# Altium project PLL.PrjPcb
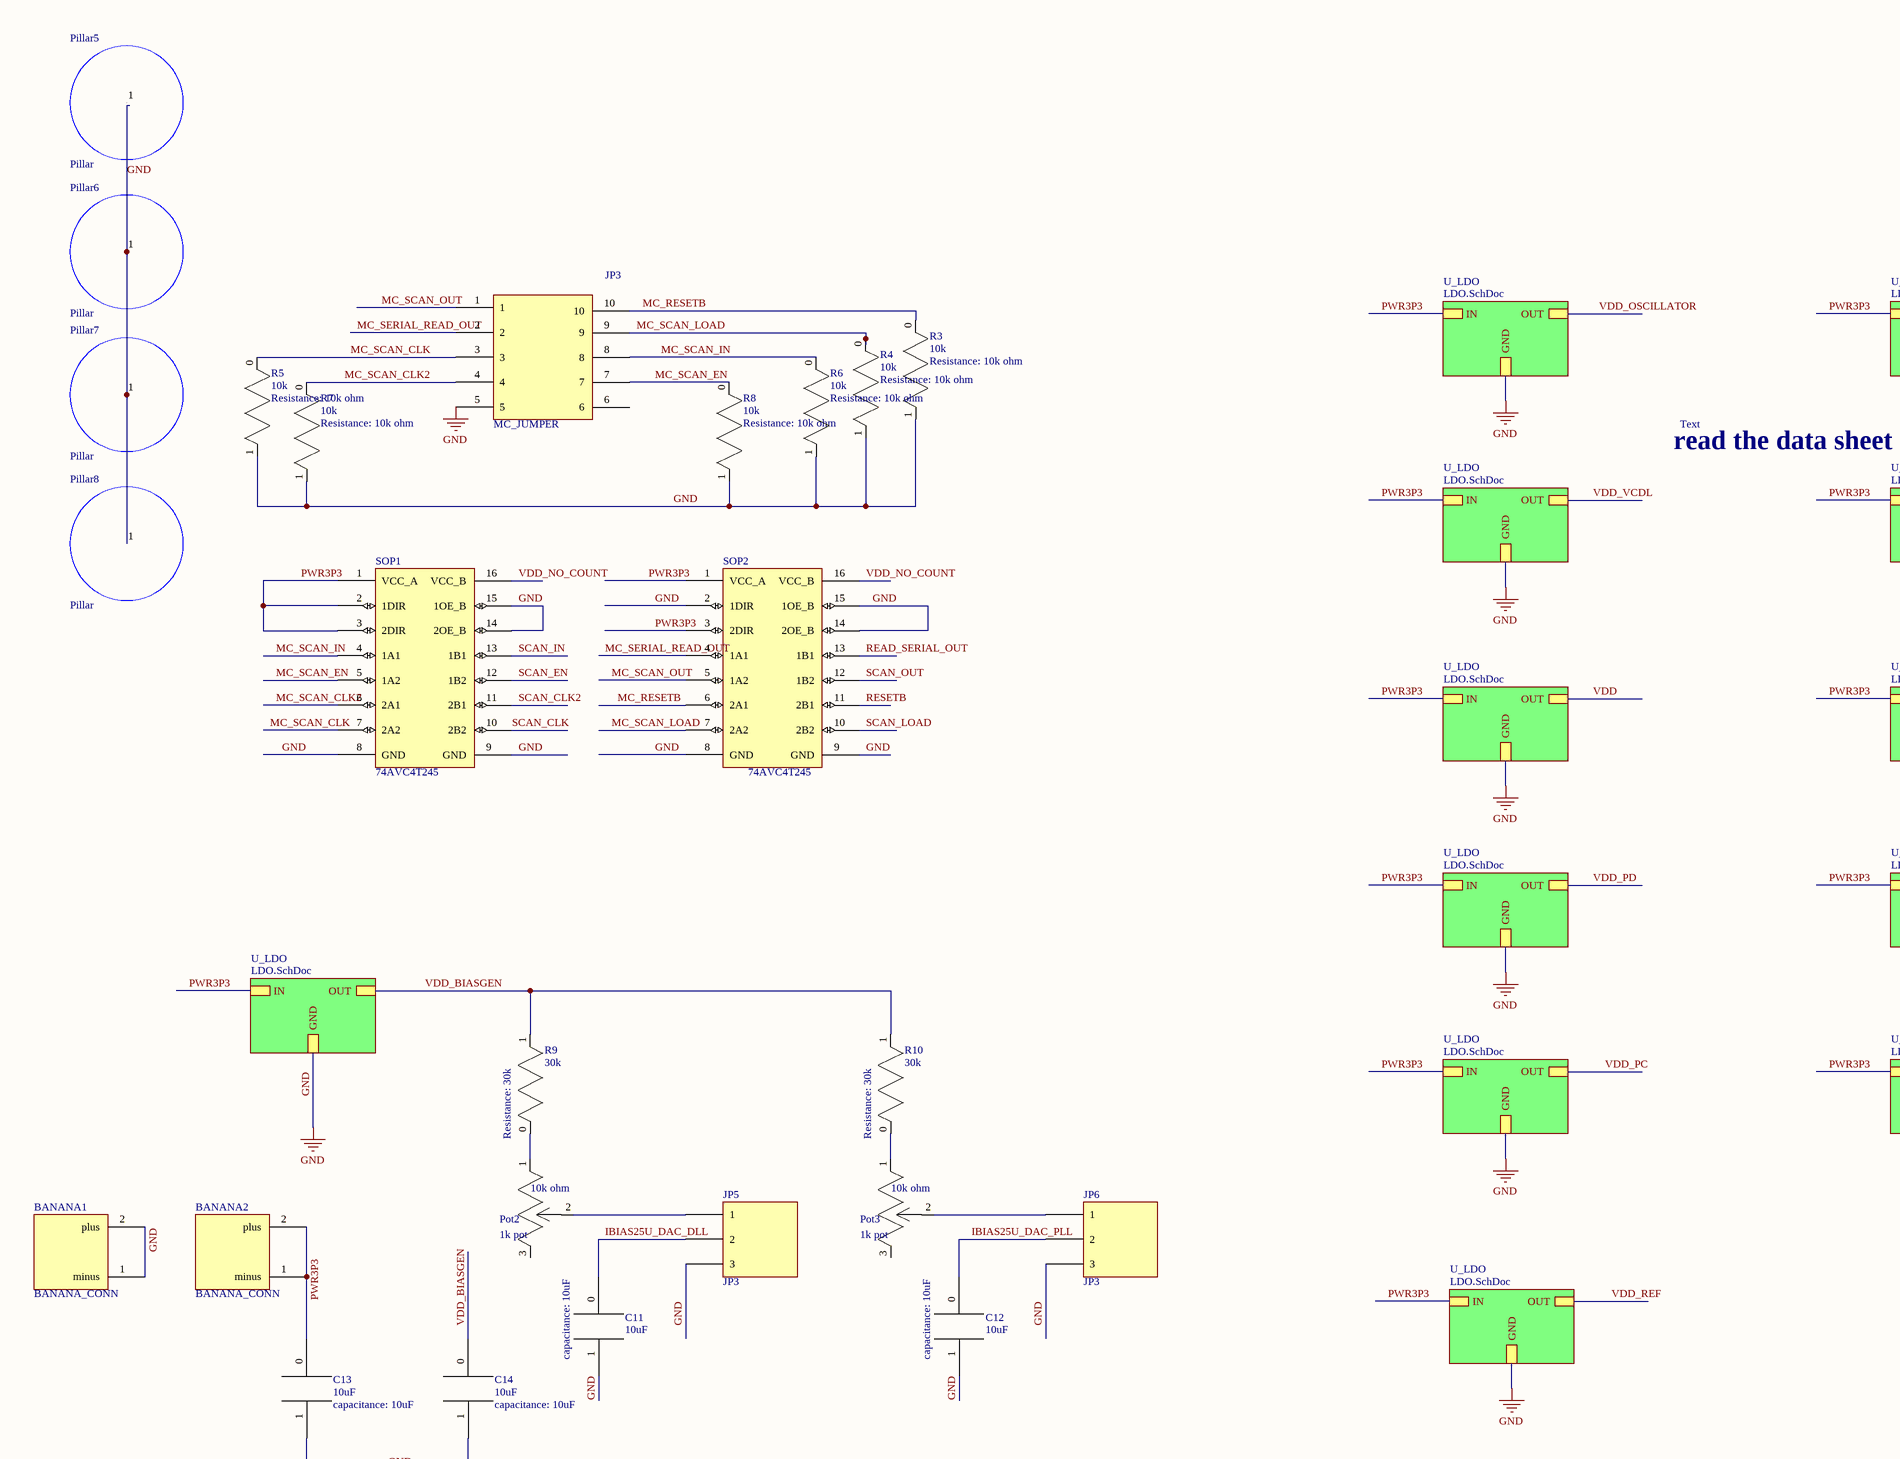
[diagram p0: MainSchematic.SchDoc, top left]
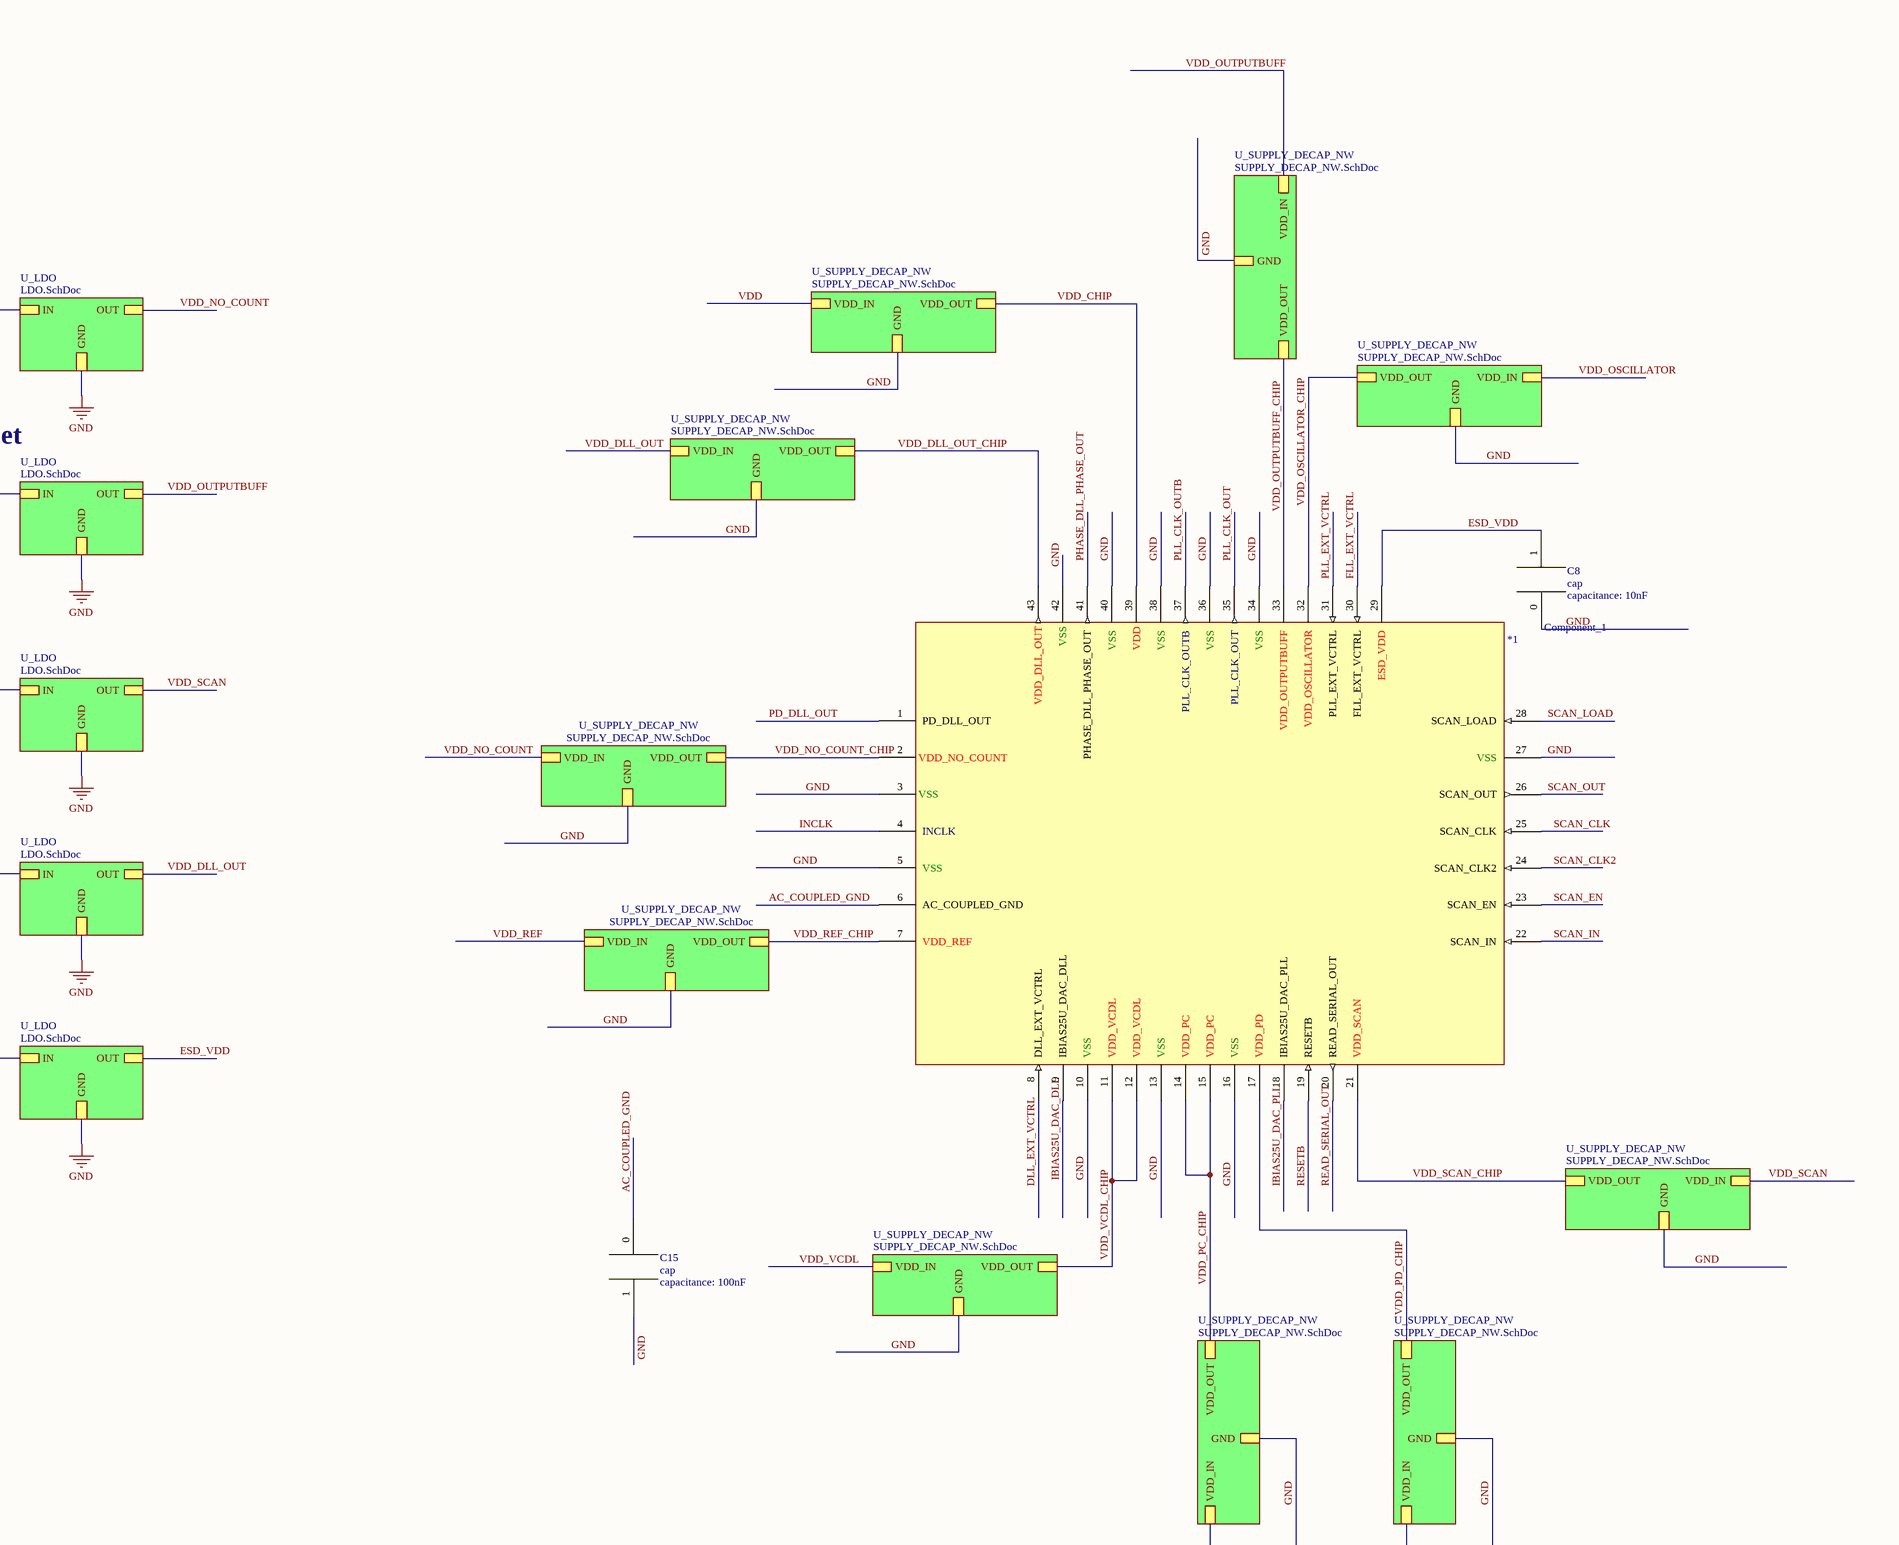
[diagram p1: MainSchematic.SchDoc, top right]
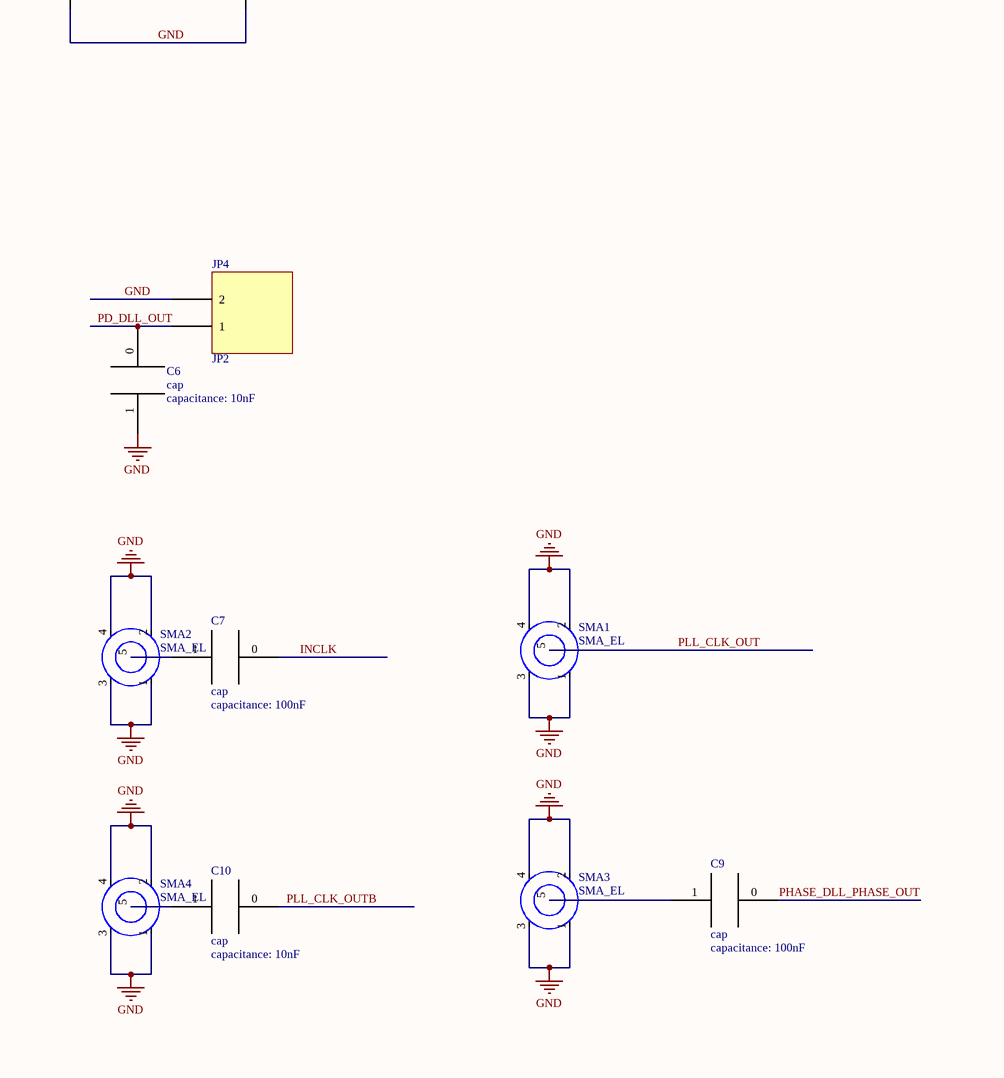
[diagram p2: MainSchematic.SchDoc, bottom left]
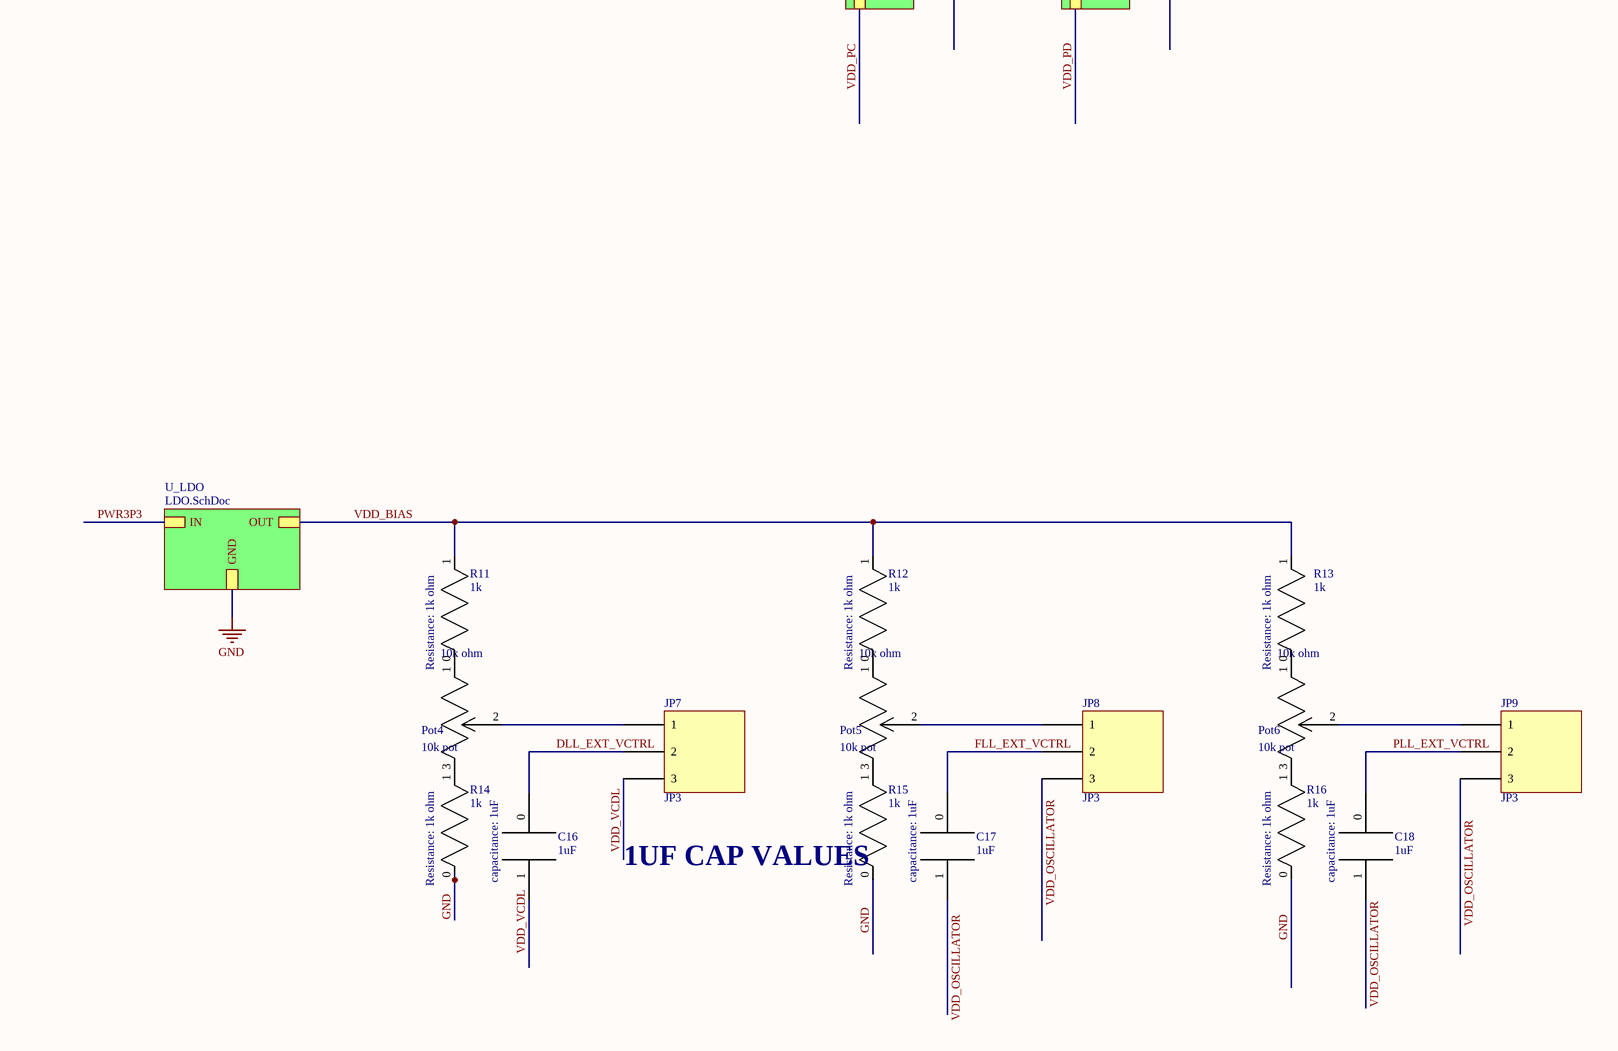
[diagram p3: MainSchematic.SchDoc, bottom right]
3 sheets, 235 parts. Net scope: hierarchical (ports join the sheet entries above them; power ports are global).
Board file: PLL_PCB.PcbDoc
Sheets:
  MainSchematic.SchDoc
    U_LDO = LDO.SchDoc
    U_LDO = LDO.SchDoc
    U_LDO = LDO.SchDoc
    U_LDO = LDO.SchDoc
    U_LDO = LDO.SchDoc
    U_LDO = LDO.SchDoc
    U_LDO = LDO.SchDoc
    U_LDO = LDO.SchDoc
    U_LDO = LDO.SchDoc
    U_LDO = LDO.SchDoc
    U_LDO = LDO.SchDoc
    U_LDO = LDO.SchDoc
    U_LDO = LDO.SchDoc
    U_SUPPLY_DECAP_NW = SUPPLY_DECAP_NW.SchDoc
    U_SUPPLY_DECAP_NW = SUPPLY_DECAP_NW.SchDoc
    U_SUPPLY_DECAP_NW = SUPPLY_DECAP_NW.SchDoc
    U_SUPPLY_DECAP_NW = SUPPLY_DECAP_NW.SchDoc
    U_SUPPLY_DECAP_NW = SUPPLY_DECAP_NW.SchDoc
    U_SUPPLY_DECAP_NW = SUPPLY_DECAP_NW.SchDoc
    U_SUPPLY_DECAP_NW = SUPPLY_DECAP_NW.SchDoc
    U_SUPPLY_DECAP_NW = SUPPLY_DECAP_NW.SchDoc
    U_SUPPLY_DECAP_NW = SUPPLY_DECAP_NW.SchDoc
    U_SUPPLY_DECAP_NW = SUPPLY_DECAP_NW.SchDoc

## Sheet MainSchematic.SchDoc
size A1

### Parts
*1  Component_1  [PCBComponent_1]
BANANA1  BANANA_CONN  [BANANA_CONN]
BANANA2  BANANA_CONN  [BANANA_CONN]
C6  cap  capacitance: 10nF  [Capacitor]
C7  cap  capacitance: 100nF  [Capacitor]
C8  cap  capacitance: 10nF  [Capacitor]
C9  cap  capacitance: 100nF  [Capacitor]
C10  cap  capacitance: 10nF  [Capacitor]
C11  10uF  [Capacitor]
C12  10uF  [Capacitor]
C13  10uF  [Capacitor]
C14  10uF  [Capacitor]
C15  cap  capacitance: 100nF  [Capacitor]
C16  1uF  [Capacitor]
C17  1uF  [Capacitor]
C18  1uF  [Capacitor]
JP3  MC_JUMPER  [JUMPER10]
JP4  JP2  [JUMPER2]
JP5  JP3  [JUMPER3]
JP6  JP3  [JUMPER3]
JP7  JP3  [JUMPER3]
JP8  JP3  [JUMPER3]
JP9  JP3  [JUMPER3]
Pillar5  Pillar  [Pillar_hole]
Pillar6  Pillar  [Pillar_hole]
Pillar7  Pillar  [Pillar_hole]
Pillar8  Pillar  [Pillar_hole]
Pot2  1k pot  Resistance: 10k ohm  [Pot]
Pot3  1k pot  Resistance: 10k ohm  [Pot]
Pot4  10k pot  Resistance: 10k ohm  [Pot]
Pot5  10k pot  Resistance: 10k ohm  [Pot]
Pot6  10k pot  Resistance: 10k ohm  [Pot]
R3  10k  Resistance: 10k ohm  [Resistor]
R4  10k  Resistance: 10k ohm  [Resistor]
R5  10k  Resistance: 10k ohm  [Resistor]
R6  10k  Resistance: 10k ohm  [Resistor]
R7  10k  Resistance: 10k ohm  [Resistor]
R8  10k  Resistance: 10k ohm  [Resistor]
R9  30k  [Resistor]
R10  30k  [Resistor]
R11  1k  Resistance: 1k ohm  [Resistor]
R12  1k  Resistance: 1k ohm  [Resistor]
R13  1k  Resistance: 1k ohm  [Resistor]
R14  1k  Resistance: 1k ohm  [Resistor]
R15  1k  Resistance: 1k ohm  [Resistor]
R16  1k  Resistance: 1k ohm  [Resistor]
SMA1  SMA_EL  [SMA_EL]
SMA2  SMA_EL  [SMA_EL]
SMA3  SMA_EL  [SMA_EL]
SMA4  SMA_EL  [SMA_EL]
SOP1  74AVC4T245  [74AVC4T245]
SOP2  74AVC4T245  [74AVC4T245]

### Sub-sheets
U_LDO = LDO.SchDoc: IN, OUT, GND
U_LDO = LDO.SchDoc: IN, OUT, GND
U_LDO = LDO.SchDoc: IN, OUT, GND
U_LDO = LDO.SchDoc: IN, OUT, GND
U_LDO = LDO.SchDoc: IN, OUT, GND
U_LDO = LDO.SchDoc: IN, OUT, GND
U_LDO = LDO.SchDoc: IN, OUT, GND
U_LDO = LDO.SchDoc: IN, OUT, GND
U_LDO = LDO.SchDoc: IN, OUT, GND
U_LDO = LDO.SchDoc: IN, OUT, GND
U_LDO = LDO.SchDoc: IN, OUT, GND
U_LDO = LDO.SchDoc: IN, OUT, GND
U_LDO = LDO.SchDoc: IN, OUT, GND
U_SUPPLY_DECAP_NW = SUPPLY_DECAP_NW.SchDoc: VDD_IN, GND, VDD_OUT
U_SUPPLY_DECAP_NW = SUPPLY_DECAP_NW.SchDoc: VDD_IN, GND, VDD_OUT
U_SUPPLY_DECAP_NW = SUPPLY_DECAP_NW.SchDoc: VDD_IN, GND, VDD_OUT
U_SUPPLY_DECAP_NW = SUPPLY_DECAP_NW.SchDoc: VDD_IN, GND, VDD_OUT
U_SUPPLY_DECAP_NW = SUPPLY_DECAP_NW.SchDoc: VDD_IN, GND, VDD_OUT
U_SUPPLY_DECAP_NW = SUPPLY_DECAP_NW.SchDoc: VDD_IN, GND, VDD_OUT
U_SUPPLY_DECAP_NW = SUPPLY_DECAP_NW.SchDoc: VDD_IN, GND, VDD_OUT
U_SUPPLY_DECAP_NW = SUPPLY_DECAP_NW.SchDoc: VDD_IN, GND, VDD_OUT
U_SUPPLY_DECAP_NW = SUPPLY_DECAP_NW.SchDoc: VDD_IN, GND, VDD_OUT
U_SUPPLY_DECAP_NW = SUPPLY_DECAP_NW.SchDoc: VDD_IN, GND, VDD_OUT

### Nets
GND: *1.3(VSS) *1.5(VSS) *1.10(VSS) *1.13(VSS) *1.16(VSS) *1.27(VSS) *1.34(VSS) *1.36(VSS) *1.38(VSS) *1.40(VSS) *1.42(VSS) BANANA1.1(minus) BANANA1.2(plus) C6.1 C8.0 C11.1 C12.1 C13.1 C14.1 C15.1 JP3.5 JP4.2 JP5.3 JP6.3 Pillar6.1 Pillar7.1 Pillar8.1 R3.1 R4.1 R5.1 R6.1 R7.1 R8.1 R14.0 R15.0 R16.0 SMA1.1 SMA1.2 SMA1.3 SMA1.4 SMA2.1 SMA2.2 SMA2.3 SMA2.4 SMA3.1 SMA3.2 SMA3.3 SMA3.4 SMA4.1 SMA4.2 SMA4.3 SMA4.4 SOP1.8(GND) SOP1.9(GND) SOP1.14(2OE_B) SOP1.15(1OE_B) SOP2.2(1DIR) SOP2.8(GND) SOP2.9(GND) SOP2.14(2OE_B) SOP2.15(1OE_B) ; sheet U_LDO/GND, sheet U_LDO/GND, sheet U_LDO/GND, sheet U_LDO/GND, sheet U_LDO/GND, sheet U_LDO/GND, sheet U_LDO/GND, sheet U_LDO/GND, sheet U_LDO/GND, sheet U_LDO/GND, sheet U_LDO/GND, sheet U_LDO/GND, sheet U_LDO/GND, sheet U_SUPPLY_DECAP_NW/GND, sheet U_SUPPLY_DECAP_NW/GND, sheet U_SUPPLY_DECAP_NW/GND, sheet U_SUPPLY_DECAP_NW/GND, sheet U_SUPPLY_DECAP_NW/GND, sheet U_SUPPLY_DECAP_NW/GND, sheet U_SUPPLY_DECAP_NW/GND, sheet U_SUPPLY_DECAP_NW/GND, sheet U_SUPPLY_DECAP_NW/GND, sheet U_SUPPLY_DECAP_NW/GND
AC_COUPLED_GND: *1.6(AC_COUPLED_GND) C15.0
DLL_EXT_VCTRL: *1.8(DLL_EXT_VCTRL) C16.0 JP7.2
ESD_VDD: *1.29(ESD_VDD) C8.1 ; sheet U_LDO/OUT
FLL_EXT_VCTRL: *1.30(FLL_EXT_VCTRL) C17.0 JP8.2
IBIAS25U_DAC_DLL: *1.9(IBIAS25U_DAC_DLL) C11.0 JP5.2
IBIAS25U_DAC_PLL: *1.18(IBIAS25U_DAC_PLL) C12.0 JP6.2
INCLK: *1.4(INCLK) C7.0
MC_RESETB: JP3.10 R3.0 SOP2.6(2A1)
MC_SCAN_CLK: JP3.3 R5.0 SOP1.7(2A2)
MC_SCAN_CLK2: JP3.4 R7.0 SOP1.6(2A1)
MC_SCAN_EN: JP3.7 R8.0 SOP1.5(1A2)
MC_SCAN_IN: JP3.8 R6.0 SOP1.4(1A1)
MC_SCAN_LOAD: JP3.9 R4.0 SOP2.7(2A2)
MC_SCAN_OUT: JP3.1 SOP2.5(1A2)
MC_SERIAL_READ_OUT: JP3.2 SOP2.4(1A1)
PD_DLL_OUT: *1.1(PD_DLL_OUT) C6.0 JP4.1
PHASE_DLL_PHASE_OUT: *1.41(PHASE_DLL_PHASE_OUT) C9.0
PLL_CLK_OUT: *1.35(PLL_CLK_OUT) SMA1.5
PLL_CLK_OUTB: *1.37(PLL_CLK_OUTB) C10.0
PLL_EXT_VCTRL: *1.31(PLL_EXT_VCTRL) C18.0 JP9.2
PWR3P3: BANANA2.1(minus) BANANA2.2(plus) C13.0 SOP1.1(VCC_A) SOP1.2(1DIR) SOP1.3(2DIR) SOP2.1(VCC_A) SOP2.3(2DIR) ; sheet U_LDO/IN, sheet U_LDO/IN, sheet U_LDO/IN, sheet U_LDO/IN, sheet U_LDO/IN, sheet U_LDO/IN, sheet U_LDO/IN, sheet U_LDO/IN, sheet U_LDO/IN, sheet U_LDO/IN, sheet U_LDO/IN, sheet U_LDO/IN, sheet U_LDO/IN  [project net IN]
READ_SERIAL_OUT: *1.20(READ_SERIAL_OUT) SOP2.13(1B1)
RESETB: *1.19(RESETB) SOP2.11(2B1)
SCAN_CLK: *1.25(SCAN_CLK) SOP1.10(2B2)
SCAN_CLK2: *1.24(SCAN_CLK2) SOP1.11(2B1)
SCAN_EN: *1.23(SCAN_EN) SOP1.12(1B2)
SCAN_IN: *1.22(SCAN_IN) SOP1.13(1B1)
SCAN_LOAD: *1.28(SCAN_LOAD) SOP2.10(2B2)
SCAN_OUT: *1.26(SCAN_OUT) SOP2.12(1B2)
VDD: sheet U_LDO/OUT, sheet U_SUPPLY_DECAP_NW/VDD_IN  [project net OUT]
VDD_BIAS: R11.1 R12.1 R13.1 ; sheet U_LDO/OUT  [project net OUT]
VDD_BIASGEN: C14.0 R9.1 R10.1 ; sheet U_LDO/OUT  [project net OUT]
VDD_CHIP: *1.39(VDD) ; sheet U_SUPPLY_DECAP_NW/VDD_OUT
VDD_DLL_OUT: sheet U_LDO/OUT, sheet U_SUPPLY_DECAP_NW/VDD_IN  [project net OUT]
VDD_DLL_OUT_CHIP: *1.43(VDD_DLL_OUT) ; sheet U_SUPPLY_DECAP_NW/VDD_OUT
VDD_NO_COUNT: SOP1.16(VCC_B) SOP2.16(VCC_B) ; sheet U_LDO/OUT, sheet U_SUPPLY_DECAP_NW/VDD_IN  [project net OUT]
VDD_NO_COUNT_CHIP: *1.2(VDD_NO_COUNT) ; sheet U_SUPPLY_DECAP_NW/VDD_OUT
VDD_OSCILLATOR: C17.1 C18.1 JP8.3 JP9.3 ; sheet U_LDO/OUT, sheet U_SUPPLY_DECAP_NW/VDD_IN  [project net OUT]
VDD_OSCILLATOR_CHIP: *1.32(VDD_OSCILLATOR) ; sheet U_SUPPLY_DECAP_NW/VDD_OUT
VDD_OUTPUTBUFF: sheet U_LDO/OUT, sheet U_SUPPLY_DECAP_NW/VDD_IN  [project net OUT]
VDD_OUTPUTBUFF_CHIP: *1.33(VDD_OUTPUTBUFF) ; sheet U_SUPPLY_DECAP_NW/VDD_OUT
VDD_PC: sheet U_LDO/OUT, sheet U_SUPPLY_DECAP_NW/VDD_IN  [project net OUT]
VDD_PC_CHIP: *1.14(VDD_PC) *1.15(VDD_PC) ; sheet U_SUPPLY_DECAP_NW/VDD_OUT
VDD_PD: sheet U_LDO/OUT, sheet U_SUPPLY_DECAP_NW/VDD_IN  [project net OUT]
VDD_PD_CHIP: *1.17(VDD_PD) ; sheet U_SUPPLY_DECAP_NW/VDD_OUT
VDD_REF: sheet U_LDO/OUT, sheet U_SUPPLY_DECAP_NW/VDD_IN  [project net OUT]
VDD_REF_CHIP: *1.7(VDD_REF) ; sheet U_SUPPLY_DECAP_NW/VDD_OUT
VDD_SCAN: sheet U_LDO/OUT, sheet U_SUPPLY_DECAP_NW/VDD_IN  [project net OUT]
VDD_SCAN_CHIP: *1.21(VDD_SCAN) ; sheet U_SUPPLY_DECAP_NW/VDD_OUT
VDD_VCDL: C16.1 JP7.3 ; sheet U_LDO/OUT, sheet U_SUPPLY_DECAP_NW/VDD_IN  [project net OUT]
VDD_VCDL_CHIP: *1.11(VDD_VCDL) *1.12(VDD_VCDL) ; sheet U_SUPPLY_DECAP_NW/VDD_OUT
NetC7_1: C7.1 SMA2.5
NetC9_1: C9.1 SMA3.5
NetC10_1: C10.1 SMA4.5
NetJP5_1: JP5.1 Pot2.2
NetJP6_1: JP6.1 Pot3.2
NetJP7_1: JP7.1 Pot4.2
NetJP8_1: JP8.1 Pot5.2
NetJP9_1: JP9.1 Pot6.2
NetPot2_1: Pot2.1 R9.0
NetPot3_1: Pot3.1 R10.0
NetPot4_1: Pot4.1 R11.0
NetPot4_3: Pot4.3 R14.1
NetPot5_1: Pot5.1 R12.0
NetPot5_3: Pot5.3 R15.1
NetPot6_1: Pot6.1 R13.0
NetPot6_3: Pot6.3 R16.1

Not connected (* = marked no-connect by the designer): JP3 6; Pillar5 1; Pot2 3; Pot3 3

### Notes on the sheet
- read the data sheet
- Text
- 1UF CAP VALUES

### Library data of the parts
BANANA1 BANANA2 = BANANA_CONN: Rule: UNIONINDEX{}0[]RULEKIND{}SolderMaskExpansion[]NETSCOPE{}AnyNet[]LAYERKIND{}SameLayer[]NAME{}Schematic Solder Mask Expansion[]EXPANSION{}5mil[]UNIT{}Imperial[]PcbType{}ProtelPcb
C6-C18 = cap: 0603cap; Rule: UNIONINDEX{}0[]RULEKIND{}SolderMaskExpansion[]NETSCOPE{}AnyNet[]LAYERKIND{}SameLayer[]NAME{}Schematic Solder Mask Expansion[]EXPANSION{}5mil[]UNIT{}Imperial[]PcbType{}ProtelPcb
  C11-C14: capacitance: 10uF
  C16-C18: capacitance: 1uF
JP3 = Jumper_10: Jumper_10p; Rule: UNIONINDEX{}0[]RULEKIND{}SolderMaskExpansion[]NETSCOPE{}AnyNet[]LAYERKIND{}SameLayer[]NAME{}Schematic Solder Mask Expansion[]EXPANSION{}5mil[]UNIT{}Imperial[]PcbType{}ProtelPcb
JP4 = Jumper_2: Rule: UNIONINDEX{}0[]RULEKIND{}SolderMaskExpansion[]NETSCOPE{}AnyNet[]LAYERKIND{}SameLayer[]NAME{}Schematic Solder Mask Expansion[]EXPANSION{}5mil[]UNIT{}Imperial[]PcbType{}ProtelPcb
JP5-JP9 = Jumper_3: Jumper_3p; Rule: UNIONINDEX{}0[]RULEKIND{}SolderMaskExpansion[]NETSCOPE{}AnyNet[]LAYERKIND{}SameLayer[]NAME{}Schematic Solder Mask Expansion[]EXPANSION{}5mil[]UNIT{}Imperial[]PcbType{}ProtelPcb
Pillar5-Pillar8 = Pillar_hole
Pot2-Pot6 = Pot: Variable Resistor; Rule: UNIONINDEX{}0[]RULEKIND{}SolderMaskExpansion[]NETSCOPE{}AnyNet[]LAYERKIND{}SameLayer[]NAME{}Schematic Solder Mask Expansion[]EXPANSION{}5mil[]UNIT{}Imperial[]PcbType{}ProtelPcb
R3-R16 = res: 0603Res; Rule: UNIONINDEX{}0[]RULEKIND{}SolderMaskExpansion[]NETSCOPE{}AnyNet[]LAYERKIND{}SameLayer[]NAME{}Schematic Solder Mask Expansion[]EXPANSION{}5mil[]UNIT{}Imperial[]PcbType{}ProtelPcb
  R9 R10: Resistance: 30k
SMA1-SMA4 = SMA_EL: Rule: UNIONINDEX{}0[]RULEKIND{}SolderMaskExpansion[]NETSCOPE{}AnyNet[]LAYERKIND{}SameLayer[]NAME{}Schematic Solder Mask Expansion[]EXPANSION{}5mil[]UNIT{}Imperial[]PcbType{}ProtelPcb
SOP1 SOP2 = 74AVC4T245: 74AVC4T245 Voltage Shifter; Rule: UNIONINDEX{}0[]RULEKIND{}SolderMaskExpansion[]NETSCOPE{}AnyNet[]LAYERKIND{}SameLayer[]NAME{}Schematic Solder Mask Expansion[]EXPANSION{}5mil[]UNIT{}Imperial[]PcbType{}ProtelPcb

## Sheet LDO.SchDoc
size A
Used 13 times, as channels U_LDO, U_LDO, U_LDO, U_LDO, U_LDO, U_LDO, U_LDO, U_LDO, U_LDO, U_LDO, U_LDO, U_LDO, U_LDO. Parts and nets are listed once, with the designators drawn on the sheet.
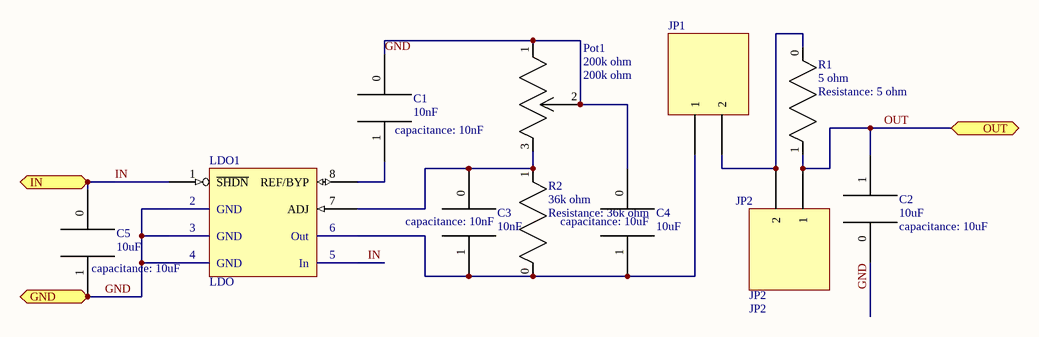
[diagram p4: LDO.SchDoc]

### Parts
C1  10nF  [Capacitor]
C2  10uF  [Capacitor]
C3  10nF  [Capacitor]
C4  10uF  [Capacitor]
C5  10uF  [Capacitor]
JP1  JP2  [JUMPER2]
JP2  JP2  [JUMPER2]
LDO1  LDO  [LT3060]
Pot1  200k ohm  [Pot]
R1  5 ohm  [Resistor]
R2  36k ohm  [Resistor]

### Ports
GND, IN, OUT

### Nets
GND: C1.0 C2.0 C4.0 C5.1 LDO1.2(GND) LDO1.3(GND) LDO1.4(GND) Pot1.1 Pot1.2 ; port GND
IN: C5.0 LDO1.1(~{SHDN}) LDO1.5(In) ; port IN
OUT: C2.1 JP2.1 R1.1 ; port OUT
NetC1_1: C1.1 LDO1.8(REF/BYP)
NetC3_0: C3.0 LDO1.7(ADJ) Pot1.3 R2.1
NetC3_1: C3.1 C4.1 JP1.1 LDO1.6(Out) R2.0
NetJP1_2: JP1.2 JP2.2 R1.0

### Channels
U_LDO: designators end in _U_LDO13; ports GND=GND IN=IN OUT=OUT
U_LDO: designators end in _U_LDO12; ports GND=GND IN=IN OUT=OUT
U_LDO: designators end in _U_LDO11; ports GND=GND IN=IN OUT=OUT
U_LDO: designators end in _U_LDO10; ports GND=GND IN=IN OUT=OUT
U_LDO: designators end in _U_LDO9; ports GND=GND IN=IN OUT=OUT
U_LDO: designators end in _U_LDO8; ports GND=GND IN=IN OUT=OUT
U_LDO: designators end in _U_LDO7; ports GND=GND IN=IN OUT=OUT
U_LDO: designators end in _U_LDO6; ports GND=GND IN=IN OUT=OUT
U_LDO: designators end in _U_LDO5; ports GND=GND IN=IN OUT=OUT
U_LDO: designators end in _U_LDO4; ports GND=GND IN=IN OUT=OUT
U_LDO: designators end in _U_LDO3; ports GND=GND IN=IN OUT=ESD_VDD
U_LDO: designators end in _U_LDO2; ports GND=GND IN=IN OUT=OUT
U_LDO: designators end in _U_LDO1; ports GND=GND IN=IN OUT=OUT

### Library data of the parts
C1-C5 = cap: as C6 on sheet MainSchematic
  C1 C3: capacitance: 10nF
  C2 C4 C5: capacitance: 10uF
JP1 JP2 = Jumper_2: as JP4 on sheet MainSchematic
LDO1 = LT3060: LT3060 LDO; Rule: UNIONINDEX{}0[]RULEKIND{}SolderMaskExpansion[]NETSCOPE{}AnyNet[]LAYERKIND{}SameLayer[]NAME{}Schematic Solder Mask Expansion[]EXPANSION{}5mil[]UNIT{}Imperial[]PcbType{}ProtelPcb
Pot1 = Pot: as Pot2 on sheet MainSchematic; Resistance: 200k ohm
R1 R2 = res: as R3 on sheet MainSchematic
  R1: Resistance: 5 ohm
  R2: Resistance: 36k ohm

## Sheet SUPPLY_DECAP_NW.SchDoc
size A
Used 10 times, as channels U_SUPPLY_DECAP_NW, U_SUPPLY_DECAP_NW, U_SUPPLY_DECAP_NW, U_SUPPLY_DECAP_NW, U_SUPPLY_DECAP_NW, U_SUPPLY_DECAP_NW, U_SUPPLY_DECAP_NW, U_SUPPLY_DECAP_NW, U_SUPPLY_DECAP_NW, U_SUPPLY_DECAP_NW. Parts and nets are listed once, with the designators drawn on the sheet.
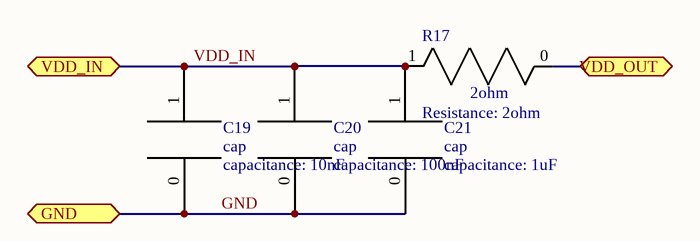
[diagram p5: SUPPLY_DECAP_NW.SchDoc]

### Parts
C19  cap  capacitance: 10nF  [Capacitor]
C20  cap  capacitance: 100nF  [Capacitor]
C21  cap  capacitance: 1uF  [Capacitor]
R17  2ohm  [Resistor]

### Ports
GND, VDD_IN, VDD_OUT

### Nets
GND: C19.0 C20.0 C21.0 ; port GND
VDD_IN: C19.1 C20.1 C21.1 R17.1 ; port VDD_IN
VDD_OUT: R17.0 ; port VDD_OUT

### Channels
U_SUPPLY_DECAP_NW: designators end in _U_SUPPLY_DECAP_NW10; ports GND=GND VDD_IN=OUT VDD_OUT=VDD_NO_COUNT_CHIP
U_SUPPLY_DECAP_NW: designators end in _U_SUPPLY_DECAP_NW9; ports GND=GND VDD_IN=OUT VDD_OUT=VDD_REF_CHIP
U_SUPPLY_DECAP_NW: designators end in _U_SUPPLY_DECAP_NW8; ports GND=GND VDD_IN=OUT VDD_OUT=VDD_VCDL_CHIP
U_SUPPLY_DECAP_NW: designators end in _U_SUPPLY_DECAP_NW7; ports GND=GND VDD_IN=OUT VDD_OUT=VDD_PC_CHIP
U_SUPPLY_DECAP_NW: designators end in _U_SUPPLY_DECAP_NW6; ports GND=GND VDD_IN=OUT VDD_OUT=VDD_PD_CHIP
U_SUPPLY_DECAP_NW: designators end in _U_SUPPLY_DECAP_NW5; ports GND=GND VDD_IN=OUT VDD_OUT=VDD_SCAN_CHIP
U_SUPPLY_DECAP_NW: designators end in _U_SUPPLY_DECAP_NW4; ports GND=GND VDD_IN=OUT VDD_OUT=VDD_OSCILLATOR_CHIP
U_SUPPLY_DECAP_NW: designators end in _U_SUPPLY_DECAP_NW3; ports GND=GND VDD_IN=OUT VDD_OUT=VDD_OUTPUTBUFF_CHIP
U_SUPPLY_DECAP_NW: designators end in _U_SUPPLY_DECAP_NW2; ports GND=GND VDD_IN=OUT VDD_OUT=VDD_CHIP
U_SUPPLY_DECAP_NW: designators end in _U_SUPPLY_DECAP_NW1; ports GND=GND VDD_IN=OUT VDD_OUT=VDD_DLL_OUT_CHIP

### Library data of the parts
C19-C21 = cap: as C6 on sheet MainSchematic
R17 = res: as R3 on sheet MainSchematic; Resistance: 2ohm

## Nets that join several sheets
GND: MainSchematic (61 pins), U_LDO (9 pins), U_LDO (9 pins), U_LDO (9 pins), U_LDO (9 pins), U_LDO (9 pins), U_LDO (9 pins), U_LDO (9 pins), U_LDO (9 pins), U_LDO (9 pins), U_LDO (9 pins), U_LDO (9 pins), U_LDO (9 pins), U_LDO (9 pins), U_SUPPLY_DECAP_NW (C19_U_SUPPLY_DECAP_NW10.0 C20_U_SUPPLY_DECAP_NW10.0 C21_U_SUPPLY_DECAP_NW10.0), U_SUPPLY_DECAP_NW (C19_U_SUPPLY_DECAP_NW9.0 C20_U_SUPPLY_DECAP_NW9.0 C21_U_SUPPLY_DECAP_NW9.0), U_SUPPLY_DECAP_NW (C19_U_SUPPLY_DECAP_NW8.0 C20_U_SUPPLY_DECAP_NW8.0 C21_U_SUPPLY_DECAP_NW8.0), U_SUPPLY_DECAP_NW (C19_U_SUPPLY_DECAP_NW7.0 C20_U_SUPPLY_DECAP_NW7.0 C21_U_SUPPLY_DECAP_NW7.0), U_SUPPLY_DECAP_NW (C19_U_SUPPLY_DECAP_NW6.0 C20_U_SUPPLY_DECAP_NW6.0 C21_U_SUPPLY_DECAP_NW6.0), U_SUPPLY_DECAP_NW (C19_U_SUPPLY_DECAP_NW5.0 C20_U_SUPPLY_DECAP_NW5.0 C21_U_SUPPLY_DECAP_NW5.0), U_SUPPLY_DECAP_NW (C19_U_SUPPLY_DECAP_NW4.0 C20_U_SUPPLY_DECAP_NW4.0 C21_U_SUPPLY_DECAP_NW4.0), U_SUPPLY_DECAP_NW (C19_U_SUPPLY_DECAP_NW3.0 C20_U_SUPPLY_DECAP_NW3.0 C21_U_SUPPLY_DECAP_NW3.0), U_SUPPLY_DECAP_NW (C19_U_SUPPLY_DECAP_NW2.0 C20_U_SUPPLY_DECAP_NW2.0 C21_U_SUPPLY_DECAP_NW2.0), U_SUPPLY_DECAP_NW (C19_U_SUPPLY_DECAP_NW1.0 C20_U_SUPPLY_DECAP_NW1.0 C21_U_SUPPLY_DECAP_NW1.0)
ESD_VDD: MainSchematic (*1.29 C8.1), U_LDO (C2_U_LDO3.1 JP2_U_LDO3.1 R1_U_LDO3.1)
IN: MainSchematic (8 pins), U_LDO (C5_U_LDO13.0 LDO1_U_LDO13.1 LDO1_U_LDO13.5), U_LDO (C5_U_LDO12.0 LDO1_U_LDO12.1 LDO1_U_LDO12.5), U_LDO (C5_U_LDO11.0 LDO1_U_LDO11.1 LDO1_U_LDO11.5), U_LDO (C5_U_LDO10.0 LDO1_U_LDO10.1 LDO1_U_LDO10.5), U_LDO (C5_U_LDO9.0 LDO1_U_LDO9.1 LDO1_U_LDO9.5), U_LDO (C5_U_LDO8.0 LDO1_U_LDO8.1 LDO1_U_LDO8.5), U_LDO (C5_U_LDO7.0 LDO1_U_LDO7.1 LDO1_U_LDO7.5), U_LDO (C5_U_LDO6.0 LDO1_U_LDO6.1 LDO1_U_LDO6.5), U_LDO (C5_U_LDO5.0 LDO1_U_LDO5.1 LDO1_U_LDO5.5), U_LDO (C5_U_LDO4.0 LDO1_U_LDO4.1 LDO1_U_LDO4.5), U_LDO (C5_U_LDO3.0 LDO1_U_LDO3.1 LDO1_U_LDO3.5), U_LDO (C5_U_LDO2.0 LDO1_U_LDO2.1 LDO1_U_LDO2.5), U_LDO (C5_U_LDO1.0 LDO1_U_LDO1.1 LDO1_U_LDO1.5)
OUT: MainSchematic (C14.0 R9.1 R10.1), U_LDO (C2_U_LDO13.1 JP2_U_LDO13.1 R1_U_LDO13.1)
OUT: MainSchematic (SOP1.16 SOP2.16), U_LDO (C2_U_LDO7.1 JP2_U_LDO7.1 R1_U_LDO7.1), U_SUPPLY_DECAP_NW (C19_U_SUPPLY_DECAP_NW10.1 C20_U_SUPPLY_DECAP_NW10.1 C21_U_SUPPLY_DECAP_NW10.1 R17_U_SUPPLY_DECAP_NW10.1)
OUT: MainSchematic (C16.1 JP7.3), U_LDO (C2_U_LDO11.1 JP2_U_LDO11.1 R1_U_LDO11.1), U_SUPPLY_DECAP_NW (C19_U_SUPPLY_DECAP_NW8.1 C20_U_SUPPLY_DECAP_NW8.1 C21_U_SUPPLY_DECAP_NW8.1 R17_U_SUPPLY_DECAP_NW8.1)
OUT: MainSchematic (C17.1 C18.1 JP8.3 JP9.3), U_LDO (C2_U_LDO12.1 JP2_U_LDO12.1 R1_U_LDO12.1), U_SUPPLY_DECAP_NW (C19_U_SUPPLY_DECAP_NW4.1 C20_U_SUPPLY_DECAP_NW4.1 C21_U_SUPPLY_DECAP_NW4.1 R17_U_SUPPLY_DECAP_NW4.1)
OUT: MainSchematic (R11.1 R12.1 R13.1), U_LDO (C2_U_LDO1.1 JP2_U_LDO1.1 R1_U_LDO1.1)
OUT: U_LDO (C2_U_LDO10.1 JP2_U_LDO10.1 R1_U_LDO10.1), U_SUPPLY_DECAP_NW (C19_U_SUPPLY_DECAP_NW2.1 C20_U_SUPPLY_DECAP_NW2.1 C21_U_SUPPLY_DECAP_NW2.1 R17_U_SUPPLY_DECAP_NW2.1)
OUT: U_LDO (C2_U_LDO9.1 JP2_U_LDO9.1 R1_U_LDO9.1), U_SUPPLY_DECAP_NW (C19_U_SUPPLY_DECAP_NW6.1 C20_U_SUPPLY_DECAP_NW6.1 C21_U_SUPPLY_DECAP_NW6.1 R17_U_SUPPLY_DECAP_NW6.1)
OUT: U_LDO (C2_U_LDO8.1 JP2_U_LDO8.1 R1_U_LDO8.1), U_SUPPLY_DECAP_NW (C19_U_SUPPLY_DECAP_NW7.1 C20_U_SUPPLY_DECAP_NW7.1 C21_U_SUPPLY_DECAP_NW7.1 R17_U_SUPPLY_DECAP_NW7.1)
OUT: U_LDO (C2_U_LDO6.1 JP2_U_LDO6.1 R1_U_LDO6.1), U_SUPPLY_DECAP_NW (C19_U_SUPPLY_DECAP_NW3.1 C20_U_SUPPLY_DECAP_NW3.1 C21_U_SUPPLY_DECAP_NW3.1 R17_U_SUPPLY_DECAP_NW3.1)
OUT: U_LDO (C2_U_LDO5.1 JP2_U_LDO5.1 R1_U_LDO5.1), U_SUPPLY_DECAP_NW (C19_U_SUPPLY_DECAP_NW5.1 C20_U_SUPPLY_DECAP_NW5.1 C21_U_SUPPLY_DECAP_NW5.1 R17_U_SUPPLY_DECAP_NW5.1)
OUT: U_LDO (C2_U_LDO4.1 JP2_U_LDO4.1 R1_U_LDO4.1), U_SUPPLY_DECAP_NW (C19_U_SUPPLY_DECAP_NW1.1 C20_U_SUPPLY_DECAP_NW1.1 C21_U_SUPPLY_DECAP_NW1.1 R17_U_SUPPLY_DECAP_NW1.1)
OUT: U_LDO (C2_U_LDO2.1 JP2_U_LDO2.1 R1_U_LDO2.1), U_SUPPLY_DECAP_NW (C19_U_SUPPLY_DECAP_NW9.1 C20_U_SUPPLY_DECAP_NW9.1 C21_U_SUPPLY_DECAP_NW9.1 R17_U_SUPPLY_DECAP_NW9.1)
VDD_CHIP: MainSchematic (*1.39), U_SUPPLY_DECAP_NW (R17_U_SUPPLY_DECAP_NW2.0)
VDD_DLL_OUT_CHIP: MainSchematic (*1.43), U_SUPPLY_DECAP_NW (R17_U_SUPPLY_DECAP_NW1.0)
VDD_NO_COUNT_CHIP: MainSchematic (*1.2), U_SUPPLY_DECAP_NW (R17_U_SUPPLY_DECAP_NW10.0)
VDD_OSCILLATOR_CHIP: MainSchematic (*1.32), U_SUPPLY_DECAP_NW (R17_U_SUPPLY_DECAP_NW4.0)
VDD_OUTPUTBUFF_CHIP: MainSchematic (*1.33), U_SUPPLY_DECAP_NW (R17_U_SUPPLY_DECAP_NW3.0)
VDD_PC_CHIP: MainSchematic (*1.14 *1.15), U_SUPPLY_DECAP_NW (R17_U_SUPPLY_DECAP_NW7.0)
VDD_PD_CHIP: MainSchematic (*1.17), U_SUPPLY_DECAP_NW (R17_U_SUPPLY_DECAP_NW6.0)
VDD_REF_CHIP: MainSchematic (*1.7), U_SUPPLY_DECAP_NW (R17_U_SUPPLY_DECAP_NW9.0)
VDD_SCAN_CHIP: MainSchematic (*1.21), U_SUPPLY_DECAP_NW (R17_U_SUPPLY_DECAP_NW5.0)
VDD_VCDL_CHIP: MainSchematic (*1.11 *1.12), U_SUPPLY_DECAP_NW (R17_U_SUPPLY_DECAP_NW8.0)